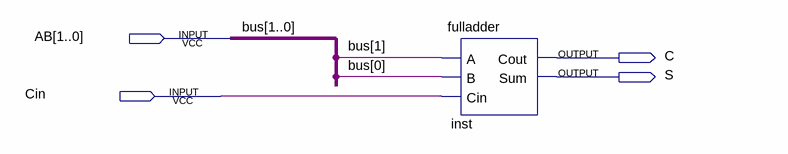
[diagram p0: schematic sheet]
// Quartus schematic fulladder_bus.bdf as structural Verilog: 1 symbols, 4 pins
module fulladder_bus (
  input  [1:0] AB,
  input  Cin,
  output C,
  output S
);

  fulladder inst (.A(AB[1]), .B(AB[0]), .Cin(Cin), .Cout(C), .Sum(S));

  // Other names for the same wires on the sheet: bus[1:0] = AB
endmodule
